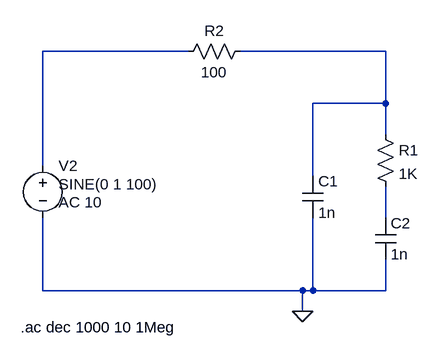
[diagram p0: schematic CR.asc]
CR.asc, the LTspice schematic file:
Version 4
SHEET 1 880 680
WIRE -16 0 -240 0
WIRE 288 0 64 0
WIRE 288 80 288 0
WIRE 288 80 176 80
WIRE 288 128 288 80
WIRE -240 176 -240 0
WIRE 176 192 176 80
WIRE 288 256 288 208
WIRE -240 368 -240 256
WIRE 160 368 -240 368
WIRE 176 368 176 256
WIRE 176 368 160 368
WIRE 288 368 288 320
WIRE 288 368 176 368
WIRE 160 400 160 368
FLAG 160 400 0
SYMBOL cap 272 256 R0
SYMATTR InstName C2
SYMATTR Value 1n
SYMATTR SpiceLine Rser=0.001
SYMBOL res 272 112 R0
SYMATTR InstName R1
SYMATTR Value 1K
SYMBOL voltage -240 160 R0
WINDOW 3 24 44 Left 2
WINDOW 123 24 72 Left 2
WINDOW 39 0 0 Left 0
SYMATTR Value SINE(0 1 100)
SYMATTR Value2 AC 10
SYMATTR InstName V2
SYMBOL res 80 -16 R90
WINDOW 0 0 56 VBottom 2
WINDOW 3 32 56 VTop 2
SYMATTR InstName R2
SYMATTR Value 100
SYMBOL cap 160 192 R0
SYMATTR InstName C1
SYMATTR Value 1n
TEXT -274 424 Left 2 !.ac dec 1000 10 1Meg

The netlist it stands for:
* CR.asc
C2 N003 0 1n Rser=0.001
R1 N002 N003 1K
V2 N001 0 SINE(0 1 100) AC 10
R2 N002 N001 100
C1 N002 0 1n
.ac dec 1000 10 1Meg
.backanno
.end